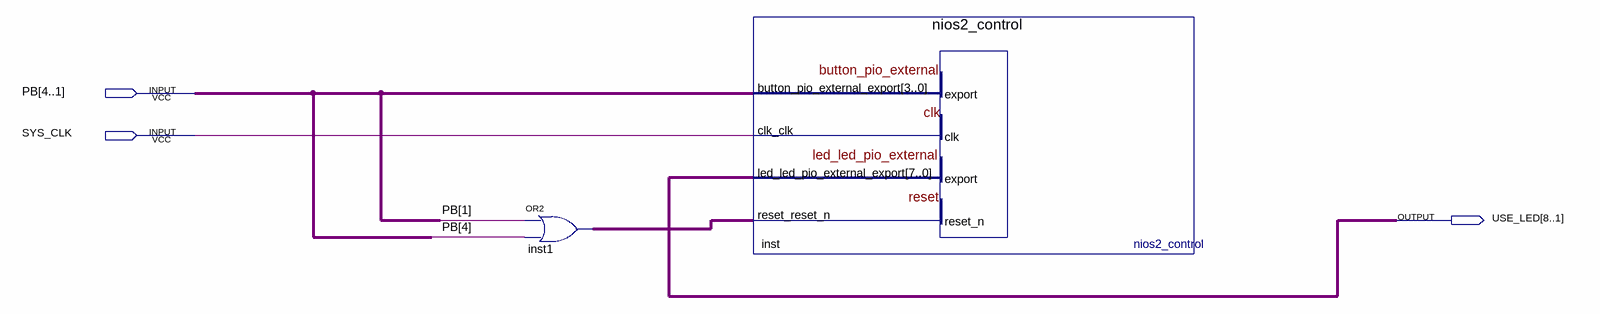
[diagram p0: schematic sheet]
// Quartus schematic BeMicro_MAX10_top.bdf as structural Verilog: 2 symbols, 3 pins
module BeMicro_MAX10_top (
  input  [4:1] PB,
  input  SYS_CLK,
  output [8:1] USE_LED
);

  wire inst1_out;

  or inst1 (inst1_out, PB[1], PB[4]);
  nios2_control inst (
    .button_pio_external_export(PB), .clk_clk(SYS_CLK), .reset_reset_n(inst1_out),
    .led_led_pio_external_export(USE_LED));
endmodule
